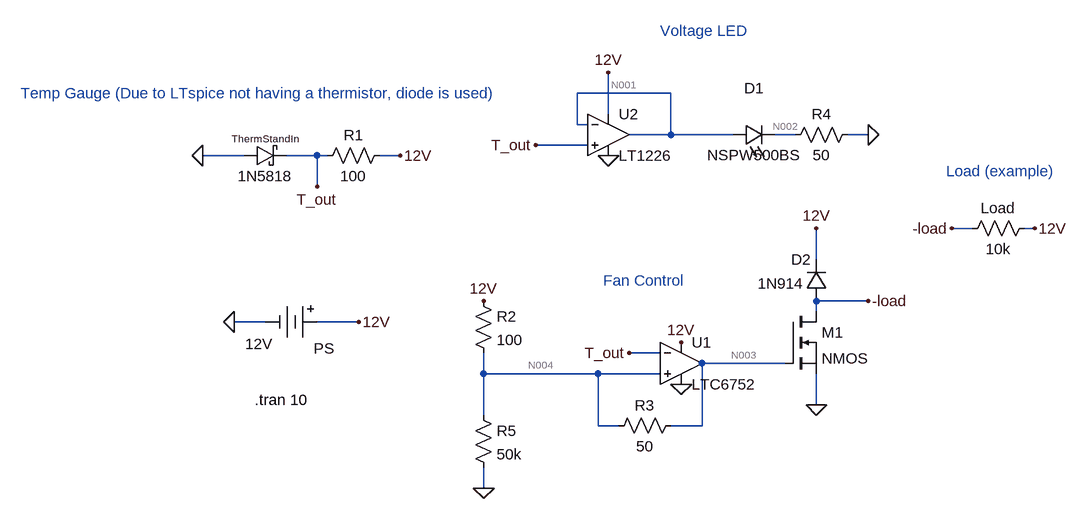
[diagram p0: schematic Model1.asc]
Model1.asc, the LTspice schematic file:
Version 4
SHEET 1 1200 680
WIRE 576 0 432 0
WIRE 480 32 480 -32
WIRE 432 48 432 0
WIRE 448 48 432 48
WIRE 576 64 576 0
WIRE 576 64 512 64
WIRE 672 64 576 64
WIRE 768 64 736 64
WIRE 880 64 848 64
WIRE 448 80 368 80
WIRE -80 96 -144 96
WIRE 32 96 -16 96
WIRE 48 96 32 96
WIRE 160 96 128 96
WIRE 32 144 32 96
WIRE 1040 208 1008 208
WIRE 1136 208 1120 208
WIRE 800 256 800 208
WIRE 880 320 800 320
WIRE 800 336 800 320
WIRE -48 352 -96 352
WIRE 96 352 32 352
WIRE 560 400 512 400
WIRE 752 416 624 416
WIRE 288 432 288 400
WIRE 464 432 288 432
WIRE 560 432 464 432
WIRE 800 480 800 432
WIRE 288 496 288 432
WIRE 464 512 464 432
WIRE 496 512 464 512
WIRE 624 512 624 416
WIRE 624 512 576 512
WIRE 288 608 288 576
FLAG 880 64 0
FLAG 800 480 0
FLAG -96 352 0
FLAG 288 608 0
FLAG -144 96 0
FLAG 96 352 12V
FLAG 1008 208 -load
FLAG 1136 208 12V
FLAG 32 144 T_out
FLAG 160 96 12V
FLAG 288 320 12V
FLAG 512 400 T_out
FLAG 592 448 0
FLAG 592 384 12V
FLAG 480 -32 12V
FLAG 480 96 0
FLAG 368 80 T_out
FLAG 800 208 12V
FLAG 880 320 -load
SYMBOL Comparators\\LTC6752 592 352 R0
SYMATTR InstName U1
SYMBOL nmos 752 336 R0
SYMATTR InstName M1
SYMBOL res 32 112 R270
WINDOW 0 32 56 VTop 2
WINDOW 3 0 56 VBottom 2
SYMATTR InstName R1
SYMATTR Value 100
SYMBOL res 272 304 R0
SYMATTR InstName R2
SYMATTR Value 100
SYMBOL Misc\\battery 48 352 R90
WINDOW 123 0 0 Left 0
WINDOW 39 0 0 Left 0
WINDOW 0 41 -10 VRight 2
WINDOW 3 34 84 VRight 2
SYMATTR InstName PS
SYMATTR Value 12V
SYMBOL Opamps\\LT1226 480 0 R0
SYMATTR InstName U2
SYMBOL res 592 496 R90
WINDOW 0 0 56 VBottom 2
WINDOW 3 32 56 VTop 2
SYMATTR InstName R3
SYMATTR Value 50
SYMBOL res 864 48 R90
WINDOW 0 0 56 VBottom 2
WINDOW 3 32 56 VTop 2
SYMATTR InstName R4
SYMATTR Value 50
SYMBOL res 1136 192 R90
WINDOW 0 0 56 VBottom 2
WINDOW 3 32 56 VTop 2
SYMATTR InstName Load
SYMATTR Value 10k
SYMBOL diode 816 320 R180
WINDOW 0 24 64 Left 2
WINDOW 3 35 27 Left 2
SYMATTR InstName D2
SYMATTR Value 1N914
SYMBOL schottky -80 112 R270
WINDOW 0 32 32 VTop 1
WINDOW 3 0 32 VBottom 2
SYMATTR InstName ThermStandIn
SYMATTR Value 1N5818
SYMATTR Description Diode
SYMATTR Type diode
SYMBOL res 272 480 R0
SYMATTR InstName R5
SYMATTR Value 50k
SYMBOL LED 672 80 R270
WINDOW 0 72 32 VTop 2
WINDOW 3 0 32 VBottom 2
SYMATTR InstName D1
SYMATTR Value NSPW500BS
TEXT -64 472 Left 2 !.tran 10
TEXT -424 0 Left 2 ;Temp Gauge (Due to LTspice not having a thermistor, diode is used)
TEXT 560 -96 Left 2 ;Voltage LED
TEXT 472 288 Left 2 ;Fan Control
TEXT 1000 120 Left 2 ;Load (example)

The netlist it stands for:
* Model1.asc
XU1 N004 T_out 12V 0 N003 LTC6752  ; pins In+ In- V+ V- OUT
M1 -load N003 0 0 NMOS
R1 T_out 12V 100
R2 12V N004 100
V§PS 12V 0 12V
XU2 T_out N001 12V 0 N001 LT1226  ; pins In+ In- V+ V- OUT
R3 N003 N004 50
R4 0 N002 50
R§Load 12V -load 10k
D2 -load 12V 1N914
D§ThermStandIn 0 T_out 1N5818
R5 N004 0 50k
D1 N001 N002 NSPW500BS
.model D D
.lib standard.dio
.model NMOS NMOS
.model PMOS PMOS
.lib standard.mos
.tran 10
* Temp Gauge (Due to LTspice not having a thermistor, diode is used)
* Voltage LED
* Fan Control
* Load (example)
.lib LTC7.lib
.backanno
.end

* Results of the author's LTspice run, read from the files saved beside the schematic
* Operating Point, zero values left out:
*   V(t_out) = 11.95 V
*   V(n004) = 11.99 V
*   V(n003) = 12 V
*   V(12v) = 12 V
*   V(-load) = 4 V
*   V(n001) = 5.629 V
*   V(n002) = 2.083 V
*   Id(M1) = 800 µA
*   Ib(M1) = -4.01 pA
*   Is(M1) = -800 µA
*   I(D1) = 41.66 mA
*   I(Thermstandin) = -31.7 µA
*   I(D2) = -2.528 nA
*   I(R5) = 239.8 µA
*   I(Load) = 800 µA
*   I(R4) = -41.66 mA
*   I(R3) = 158.4 µA
*   I(R2) = 82.36 µA
*   I(R1) = -457.3 µA
*   I(Ps) = -56.9 mA
*   Ix(u1:1) = 883.3 nA
*   Ix(u1:2) = -202.3 nA
*   Ix(u1:3) = 8.225 mA
*   Ix(u1:4) = -8.067 mA
*   Ix(u1:5) = -158.4 µA
*   Ix(u2:1) = 425.8 µA
*   Ix(u2:2) = -417.7 µA
*   Ix(u2:3) = 47.34 mA
*   Ix(u2:4) = -6.109 mA
*   Ix(u2:5) = -41.24 mA